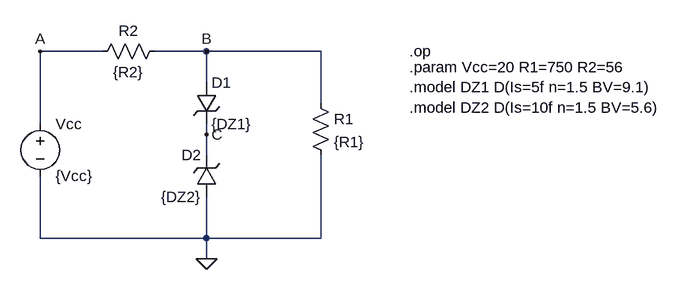
[diagram p0: schematic Lab EaD 01 D.asc]
Lab EaD 01 D.asc, the LTspice schematic file:
Version 4
SHEET 1 892 680
WIRE -16 32 -112 32
WIRE 144 32 64 32
WIRE 320 32 144 32
WIRE 144 80 144 32
WIRE 320 112 320 32
WIRE -112 144 -112 32
WIRE 144 160 144 144
WIRE 144 192 144 160
WIRE -112 320 -112 224
WIRE 144 320 144 256
WIRE 144 320 -112 320
WIRE 320 320 320 192
WIRE 320 320 144 320
WIRE 144 352 144 320
FLAG -112 32 A
FLAG 144 352 0
FLAG 144 32 B
FLAG 144 160 C
SYMBOL voltage -112 128 R0
SYMATTR InstName Vcc
SYMATTR Value {Vcc}
SYMBOL res -32 48 R270
WINDOW 0 32 56 VTop 2
WINDOW 3 0 56 VBottom 2
SYMATTR InstName R2
SYMATTR Value {R2}
SYMBOL zener 128 80 R0
SYMATTR InstName D1
SYMATTR Value {DZ1}
SYMBOL zener 160 256 R180
WINDOW 0 24 64 Left 2
WINDOW 3 24 0 Left 2
SYMATTR InstName D2
SYMATTR Value {DZ2}
SYMBOL res 304 96 R0
SYMATTR InstName R1
SYMATTR Value {R1}
TEXT 456 32 Left 2 !.op
TEXT 456 56 Left 2 !.param Vcc=20 R1=750 R2=56\n.model DZ1 D(Is=5f n=1.5 BV=9.1)\n.model DZ2 D(Is=10f n=1.5 BV=5.6)

The netlist it stands for:
* Lab EaD 01 D.asc
Vcc A 0 {Vcc}
R2 A B {R2}
D1 B C {DZ1}
D2 0 C {DZ2}
R1 B 0 {R1}
.model D D
.lib standard.dio
.op
.param Vcc=20 R1=750 R2=56
.model DZ1 D(Is=5f n=1.5 BV=9.1)
.model DZ2 D(Is=10f n=1.5 BV=5.6)
.backanno
.end

* Results of the author's LTspice run, read from the files saved beside the schematic
* Operating Point:
*   V(a) = 20 V
*   V(b) = 7.374 V
*   V(c) = 6.156 V
*   I(D2) = -215.6 mA
*   I(D1) = 215.6 mA
*   I(R1) = 9.832 mA
*   I(R2) = 225.5 mA
*   I(Vcc) = -225.5 mA
* From the log:
*   Semiconductor Device Operating Points:
*                           --- Diodes ---
*   Name:      d2          d1
*   Model:     dz2         dz1
*   Id:     -2.16e-01    2.16e-01
*   Vd:     -6.16e+00    1.22e+00
*   Req:     1.20e-01    1.80e-01
*   CAP:     0.00e+00    0.00e+00